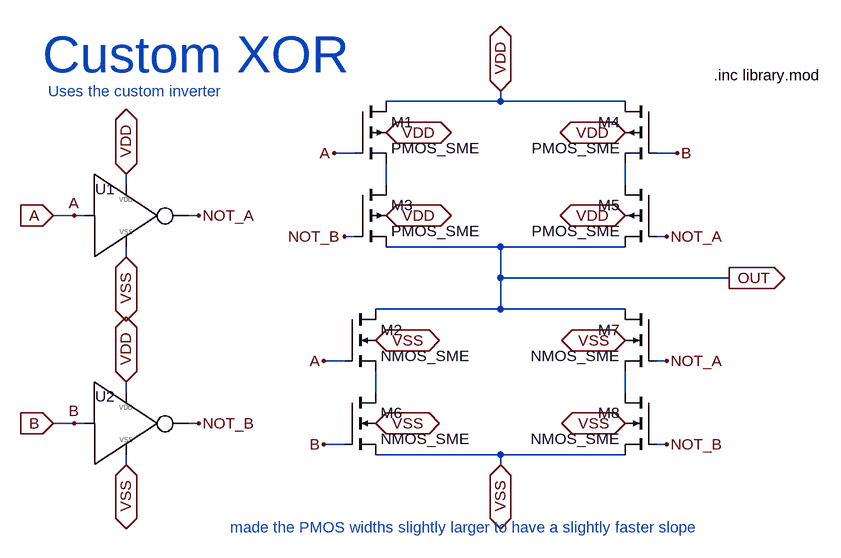
[diagram p0: schematic my_xor.asc]
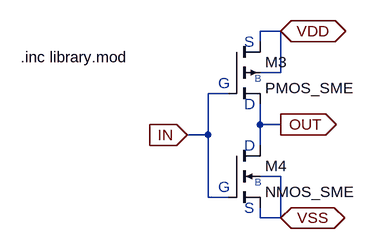
[diagram p1: sub-circuit my_inverter.asc]
my_xor.asc, the LTspice schematic file:
Version 4.1
SHEET 1 1092 680
WIRE 352 -160 352 -176
WIRE 352 -160 176 -160
WIRE 544 -160 352 -160
WIRE 128 -80 96 -80
WIRE 624 -80 592 -80
WIRE -224 -32 -224 -48
WIRE 176 -32 176 -64
WIRE 544 -32 544 -64
WIRE -304 16 -336 16
WIRE -288 16 -304 16
WIRE -112 16 -128 16
WIRE 128 48 112 48
WIRE 608 48 592 48
WIRE 352 64 176 64
WIRE 544 64 352 64
WIRE -224 80 -224 64
WIRE 352 112 352 64
WIRE 704 112 352 112
WIRE 352 160 352 112
WIRE 352 160 160 160
WIRE 544 160 352 160
WIRE 112 240 80 240
WIRE 608 240 592 240
WIRE -224 288 -224 272
WIRE 160 288 160 256
WIRE 544 288 544 256
WIRE -304 336 -336 336
WIRE -288 336 -304 336
WIRE -112 336 -128 336
WIRE 112 368 80 368
WIRE 608 368 592 368
WIRE 352 384 160 384
WIRE 544 384 352 384
WIRE -224 400 -224 384
WIRE 352 400 352 384
FLAG -336 16 A
IOPIN -336 16 In
FLAG 704 112 OUT
IOPIN 704 112 Out
FLAG -224 400 VSS
IOPIN -224 400 BiDir
FLAG -336 336 B
IOPIN -336 336 In
FLAG 352 -176 VDD
IOPIN 352 -176 BiDir
FLAG -304 16 A
FLAG -112 16 NOT_A
FLAG -304 336 B
FLAG -112 336 NOT_B
FLAG -224 80 VSS
IOPIN -224 80 BiDir
FLAG -224 -48 VDD
IOPIN -224 -48 BiDir
FLAG -224 272 VDD
IOPIN -224 272 BiDir
FLAG 352 400 VSS
IOPIN 352 400 BiDir
FLAG 160 336 VSS
IOPIN 160 336 BiDir
FLAG 544 336 VSS
IOPIN 544 336 BiDir
FLAG 544 208 VSS
IOPIN 544 208 BiDir
FLAG 160 208 VSS
IOPIN 160 208 BiDir
FLAG 176 -112 VDD
IOPIN 176 -112 BiDir
FLAG 544 -112 VDD
IOPIN 544 -112 BiDir
FLAG 544 16 VDD
IOPIN 544 16 BiDir
FLAG 176 16 VDD
IOPIN 176 16 BiDir
FLAG 96 -80 A
FLAG 624 -80 B
FLAG 608 48 NOT_A
FLAG 112 48 NOT_B
FLAG 80 240 A
FLAG 608 240 NOT_A
FLAG 80 368 B
FLAG 608 368 NOT_B
SYMBOL pmos4 128 -160 R0
SYMATTR InstName M1
SYMATTR Value PMOS_SME
SYMATTR Value2 l=0.35u w=1u
SYMBOL nmos4 112 160 R0
SYMATTR InstName M2
SYMATTR Value NMOS_SME
SYMATTR Value2 l=0.35u w=0.4u
SYMBOL my_inverter -224 16 R0
WINDOW 0 -32 -25 Bottom 2
SYMATTR InstName U1
SYMBOL my_inverter -224 336 R0
WINDOW 0 -32 -26 Bottom 2
SYMATTR InstName U2
SYMBOL pmos4 128 -32 R0
SYMATTR InstName M3
SYMATTR Value PMOS_SME
SYMATTR Value2 l=0.35u w=1u
SYMBOL pmos4 592 -160 M0
SYMATTR InstName M4
SYMATTR Value PMOS_SME
SYMATTR Value2 l=0.35u w=1u
SYMBOL pmos4 592 -32 M0
SYMATTR InstName M5
SYMATTR Value PMOS_SME
SYMATTR Value2 l=0.35u w=1u
SYMBOL nmos4 112 288 R0
SYMATTR InstName M6
SYMATTR Value NMOS_SME
SYMATTR Value2 l=0.35u w=0.4u
SYMBOL nmos4 592 160 M0
SYMATTR InstName M7
SYMATTR Value NMOS_SME
SYMATTR Value2 l=0.35u w=0.4u
SYMBOL nmos4 592 288 M0
SYMATTR InstName M8
SYMATTR Value NMOS_SME
SYMATTR Value2 l=0.35u w=0.4u
TEXT -352 -232 Left 6 ;Custom XOR
TEXT -344 -176 Left 2 ;Uses the custom inverter
TEXT 680 -200 Left 2 !.inc library.mod
TEXT -64 496 Left 2 ;made the PMOS widths slightly larger to have a slightly faster slope

my_inverter.asc, the sub-circuit schematic file:
Version 4.1
SHEET 1 880 680
WIRE 608 -32 576 -32
WIRE 576 -16 576 -32
WIRE 608 32 608 -32
WIRE 608 32 576 32
WIRE 528 64 496 64
WIRE 576 112 576 80
WIRE 608 112 576 112
WIRE 496 128 496 64
WIRE 496 128 464 128
WIRE 576 144 576 112
WIRE 608 192 576 192
WIRE 496 224 496 128
WIRE 528 224 496 224
WIRE 576 256 576 240
WIRE 608 256 608 192
WIRE 608 256 576 256
FLAG 608 -32 VDD
IOPIN 608 -32 BiDir
FLAG 608 256 VSS
IOPIN 608 256 BiDir
FLAG 608 112 OUT
IOPIN 608 112 Out
FLAG 464 128 IN
IOPIN 464 128 In
SYMBOL pmos4 528 -16 R0
SYMATTR InstName M3
SYMATTR Value PMOS_SME
SYMATTR Value2 l=0.35u w=0.4u
SYMBOL nmos4 528 144 R0
SYMATTR InstName M4
SYMATTR Value NMOS_SME
SYMATTR Value2 l=0.35u w=0.4u
TEXT 552 -16 Left 2 ;S
TEXT 552 240 Left 2 ;S
TEXT 552 80 Left 2 ;D
TEXT 552 144 Left 2 ;D
TEXT 512 48 Left 2 ;G
TEXT 512 208 Left 2 ;G
TEXT 568 40 Left 1 ;B
TEXT 568 200 Left 1 ;B
TEXT 208 8 Left 2 !.inc library.mod

The netlist it stands for:
* my_xor.asc
M1 VDD A N001 VDD PMOS_SME l=0.35u w=1u
M2 OUT A N003 VSS NMOS_SME l=0.35u w=0.4u
X§U1 A NOT_A VDD VSS my_inverter
X§U2 B NOT_B VDD VSS my_inverter
M3 N001 NOT_B OUT VDD PMOS_SME l=0.35u w=1u
M4 VDD B N002 VDD PMOS_SME l=0.35u w=1u
M5 N002 NOT_A OUT VDD PMOS_SME l=0.35u w=1u
M6 N003 B VSS VSS NMOS_SME l=0.35u w=0.4u
M7 OUT NOT_A N004 VSS NMOS_SME l=0.35u w=0.4u
M8 N004 NOT_B VSS VSS NMOS_SME l=0.35u w=0.4u

* block symbol definitions
.subckt my_inverter IN OUT VDD VSS
M3 VDD IN OUT VDD PMOS_SME l=0.35u w=0.4u
M4 OUT IN VSS VSS NMOS_SME l=0.35u w=0.4u
* S
* S
* D
* D
* G
* G
* B
* B
.inc library.mod
.ends my_inverter

.model NMOS NMOS
.model PMOS PMOS
.lib standard.mos
* Custom XOR
* Uses the custom inverter
.inc library.mod
* made the PMOS widths slightly larger to have a slightly faster slope
.backanno
.end